# Altium schematic sheet power_switch.SchDoc
size A4
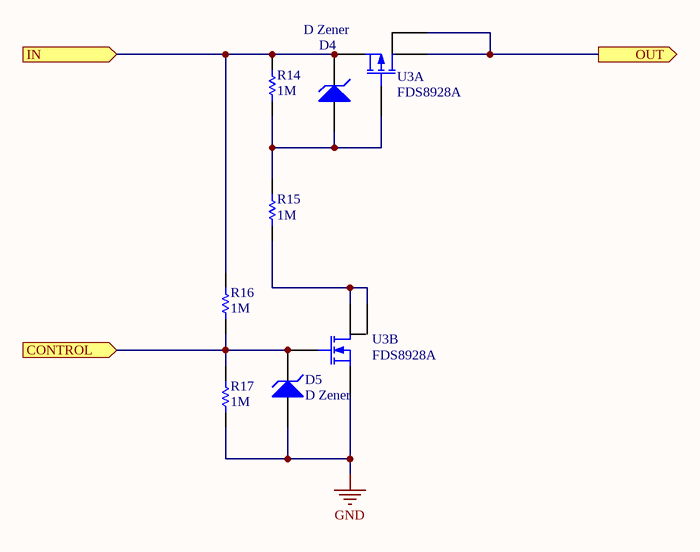
[diagram p0: power_switch.SchDoc]

## Parts
D4  D Zener  [MM3Z]
D5  D Zener  [MM3Z]
R14  1M  [R0603]
R15  1M  [R0603]
R16  1M  [R0603]
R17  1M  [R0603]
U3  FDS8928A  [FDS8928A]  (parts A,B of 2)

## Ports
CONTROL (in), IN (in), OUT (out)

## Nets
GND: D5.1(A) R17.1 U3.1(S_N)
CONTROL: D5.2(K) R16.1 R17.2 U3.2(G_N) ; port CONTROL
IN: D4.2(K) R14.2 R16.2 U3.3(S_P) ; port IN
OUT: U3.5(D_P) U3.6(D_N) ; port OUT
NetD4_1: D4.1(A) R14.1 R15.2 U3.4(G_P)
NetR15_1: R15.1 U3.7(D_N) U3.8(D_N)

## Library data of the parts
D4 D5 = D Zener: Zener Diode; pin to pad: 1>A 2>K; Published: 8-Jun-2000; LatestRevisionDate: 17-Jul-2002; LatestRevisionNote: Re-released for DXP Platform.; PackageReference: DIODE-0.7; Publisher: Altium Limited; farnell: 1431207
R14-R17 = Res1: Resistor; Published: 8-Jun-2000; LatestRevisionDate: 17-Jul-2002; LatestRevisionNote: Re-released for DXP Platform.; PackageReference: AXIAL-0.3; Publisher: Altium Limited; Value: 1M; farnell: 9330410
U3 = FDS8928A: MOSFET, DUAL, NP, SMD, 8-SOIC; farnell: 1467988